# Altium schematic sheet rhd64_board_no_microdrive.SchDoc
size A4
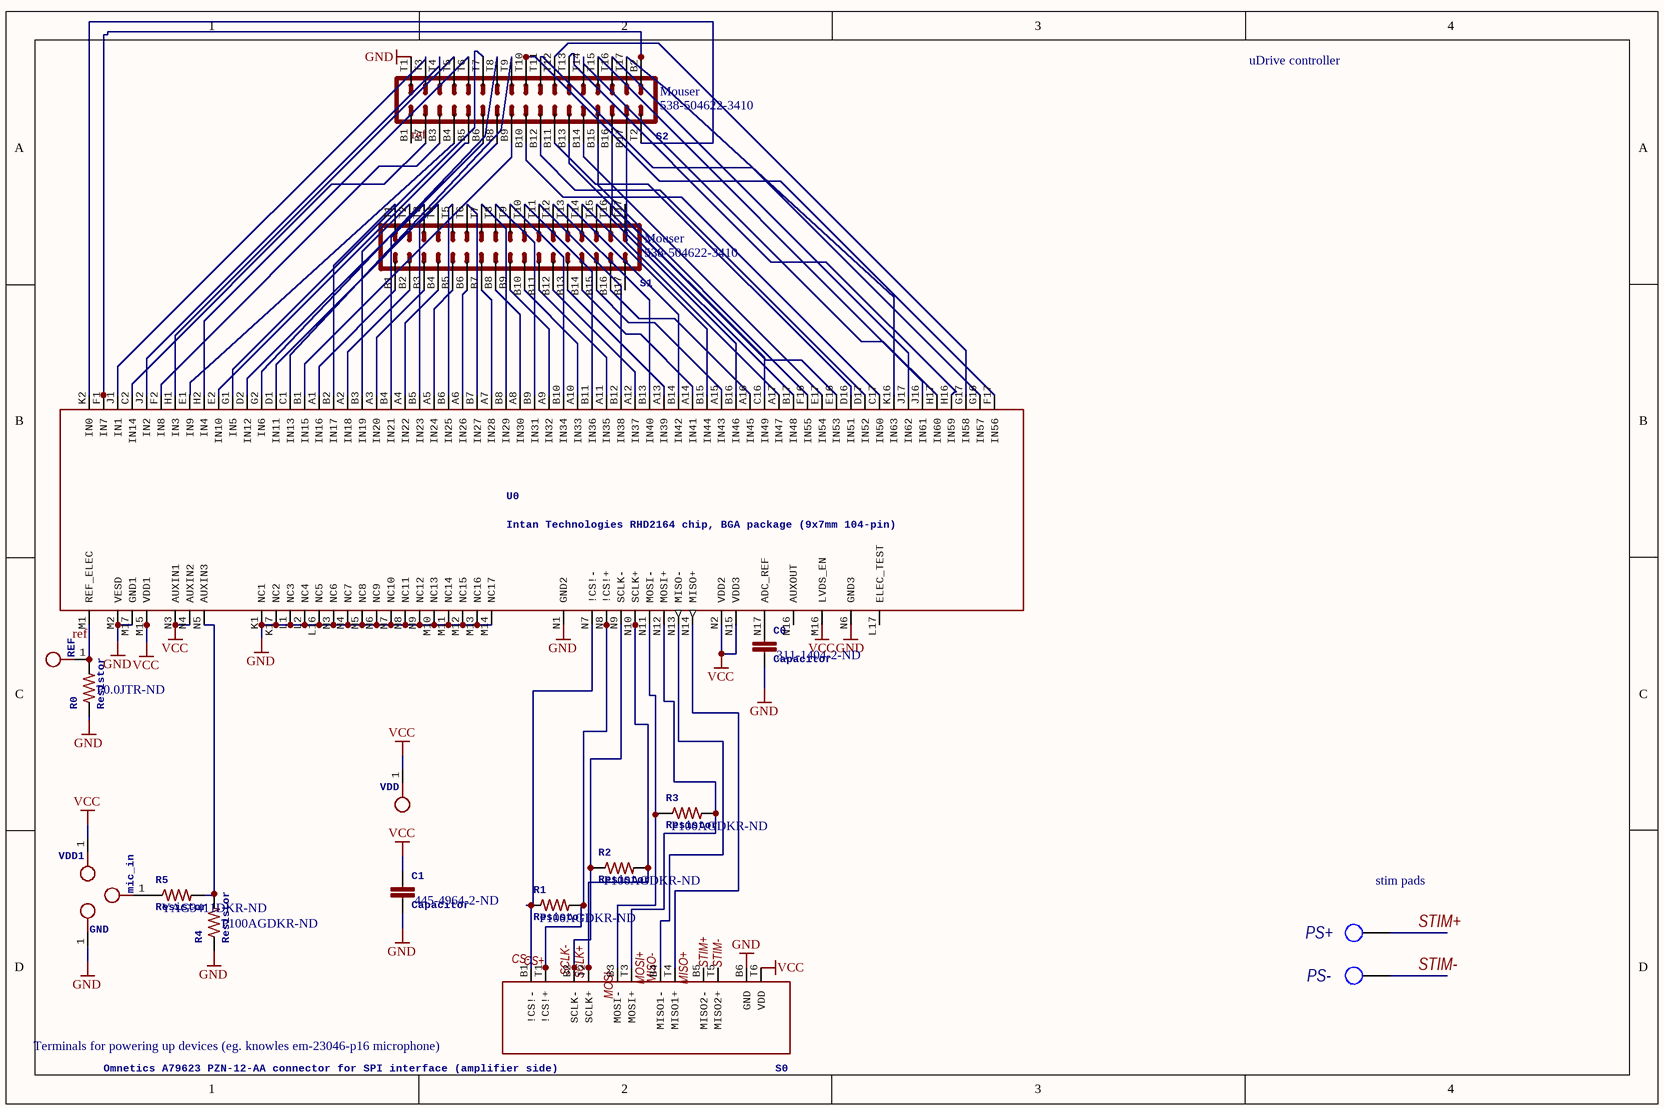
[diagram p0: rhd64_board_no_microdrive.SchDoc]

## Parts
C0  Capacitor  Supplier Part Number 1: 311-1404-2-ND  [0201]
C1  Capacitor  Supplier Part Number 1: 445-4964-2-ND  [0402]
GND  PCB Test Point  [TESTPOINT_SMALL]  (value not drawn)
mic_in  PCB Test Point  [TESTPOINT_SMALL]  (value not drawn)
PS+  2-2  [KP-025-04]  (value not drawn)
PS-  2-2  [KP-025-04]  (value not drawn)
R0  Resistor  Supplier Part Number 1: P0.0JTR-ND  [0402]
R1  Resistor  Supplier Part Number 1: P100AGDKR-ND  [0201]
R2  Resistor  Supplier Part Number 1: P100AGDKR-ND  [0201]
R3  Resistor  Supplier Part Number 1: P100AGDKR-ND  [0201]
R4  Resistor  Supplier Part Number 1: P100AGDKR-ND  [0201]
R5  Resistor  Supplier Part Number 1: YAG3411DKR-ND  [0201]
REF  PCB Test Point  [TESTPOINT_SMALL]  (value not drawn)
S0  Omnetics A79623 PZN-12-AA connector for SPI interface (amplifier side)  [OMNETICS_PZN-12-AA]
S1  Supplier 1: Mouser  Supplier Part Number 1: 538-504622-3410  [MOLEX_504622-3412]  (hidden comment: Molex 3.5mm Pitch Slimstack 34 pin connector)
S2  Supplier 1: Mouser  Supplier Part Number 1: 538-504622-3410  [MOLEX_504622-3412]  (hidden comment: Molex 3.5mm Pitch Slimstack 34 pin connector)
U0  Intan Technologies RHD2164 chip, BGA package (9x7mm 104-pin)  [BGA104_9X7]
VDD  PCB Test Point  [TESTPOINT_SMALL]  (value not drawn)
VDD1  PCB Test Point  [TESTPOINT_SMALL]  (value not drawn)

## Nets
GND: C0.2 C1.2 GND.1 R0.1 R4.1 S0.B6(GND) S2.T1 U0.K1(NC1) U0.K17(NC2) U0.L1(NC3) U0.L2(NC4) U0.L16(NC5) U0.M2(VESD) U0.M3(NC6) U0.M4(NC7) U0.M5(NC8) U0.M6(NC9) U0.M7(NC10) U0.M8(NC11) U0.M9(NC12) U0.M10(NC13) U0.M11(NC14) U0.M12(NC15) U0.M13(NC16) U0.M14(NC17) U0.M17(GND1) U0.N1(GND2) U0.N6(GND3)
VCC: C1.1 S0.T6(VDD) U0.M15(VDD1) U0.M16(LVDS_EN) U0.N2(VDD2) U0.N3(AUXIN1) U0.N4(AUXIN2) U0.N15(VDD3) VDD.1 VDD1.1
CS+: R1.2 S0.T1(!CS!+) U0.N8(!CS!+)
CS-: R1.1 S0.B1(!CS!-) U0.N7(!CS!-)
MISO+: S0.T4(MISO1+) U0.N14(MISO+)
MISO-: S0.B4(MISO1-) U0.N13(MISO-)
MOSI+: R3.2 S0.T3(MOSI+) U0.N12(MOSI+)
MOSI-: R3.1 S0.B3(MOSI-) U0.N11(MOSI-)
ref: R0.2 REF.1 S2.B1 U0.M1(REF_ELEC)
SCLK+: R2.2 S0.T2(SCLK+) U0.N10(SCLK+)
SCLK-: R2.1 S0.B2(SCLK-) U0.N9(SCLK-)
STIM+: PS+.1 S0.B5(MISO2-)
STIM-: PS-.1 S0.T5(MISO2+)
NetC0_1: C0.1 U0.N17(ADC_REF)
Netmic_in_1: mic_in.1 R5.1
NetR4_2: R4.2 R5.2 U0.N5(AUXIN3)
NetS1_B1: S1.B1 U0.A1(IN16)
NetS1_B2: S1.B2 U0.A2(IN18)
NetS1_B3: S1.B3 U0.A3(IN20)
NetS1_B4: S1.B4 U0.A4(IN22)
NetS1_B5: S1.B5 U0.A5(IN24)
NetS1_B6: S1.B6 U0.A6(IN26)
NetS1_B7: S1.B7 U0.A7(IN28)
NetS1_B8: S1.B8 U0.A8(IN30)
NetS1_B9: S1.B9 U0.A9(IN32)
NetS1_B10: S1.B10 U0.A10(IN33)
NetS1_B11: S1.B11 U0.A11(IN35)
NetS1_B12: S1.B12 U0.A12(IN37)
NetS1_B13: S1.B13 U0.A13(IN39)
NetS1_B14: S1.B14 U0.A14(IN41)
NetS1_B15: S1.B15 U0.A15(IN43)
NetS1_B16: S1.B16 U0.A16(IN45)
NetS1_T1: S1.T1 U0.B2(IN17)
NetS1_T2: S1.T2 U0.B3(IN19)
NetS1_T3: S1.T3 U0.B4(IN21)
NetS1_T4: S1.T4 U0.B5(IN23)
NetS1_T5: S1.T5 U0.B6(IN25)
NetS1_T6: S1.T6 U0.B7(IN27)
NetS1_T7: S1.T7 U0.B8(IN29)
NetS1_T8: S1.T8 U0.B9(IN31)
NetS1_T9: S1.T9 U0.B10(IN34)
NetS1_T10: S1.T10 U0.B11(IN36)
NetS1_T11: S1.T11 U0.B12(IN38)
NetS1_T12: S1.T12 U0.B13(IN40)
NetS1_T13: S1.T13 U0.B14(IN42)
NetS1_T14: S1.T14 U0.B15(IN44)
NetS1_T15: S1.T15 U0.B16(IN46)
NetS1_T16: S1.T16 S2.B13 U0.C16(IN49) U0.E16(IN53)
NetS2_B2: S2.B2 U0.F1(IN7)
NetS2_B3: S2.B3 U0.F2(IN8)
NetS2_B4: S2.B4 U0.E1(IN9)
NetS2_B5: S2.B5 U0.E2(IN10)
NetS2_B6: S2.B6 U0.D2(IN12)
NetS2_B7: S2.B7 U0.C2(IN14)
NetS2_B8: S2.B8 U0.D1(IN11)
NetS2_B9: S2.B9 U0.B1(IN15)
NetS2_B10: S2.B10 U0.C17(IN50)
NetS2_B11: S2.B11 U0.D16(IN51)
NetS2_B12: S2.B12 U0.D17(IN52)
NetS2_B14: S2.B14 U0.E17(IN54)
NetS2_B15: S2.B15 U0.F16(IN55)
NetS2_B16: S2.B16 U0.B17(IN48)
NetS2_B17: S2.B17 U0.A17(IN47)
NetS2_T2: S2.T2 U0.K2(IN0)
NetS2_T3: S2.T3 U0.J1(IN1)
NetS2_T4: S2.T4 U0.J2(IN2)
NetS2_T5: S2.T5 U0.H1(IN3)
NetS2_T6: S2.T6 U0.H2(IN4)
NetS2_T7: S2.T7 U0.G1(IN5)
NetS2_T8: S2.T8 U0.G2(IN6)
NetS2_T9: S2.T9 U0.C1(IN13)
NetS2_T10: S2.T10 U0.F17(IN56)
NetS2_T11: S2.T11 S2.T17 U0.G16(IN57) U0.K16(IN63)
NetS2_T12: S2.T12 U0.G17(IN58)
NetS2_T13: S2.T13 U0.H16(IN59)
NetS2_T14: S2.T14 U0.H17(IN60)
NetS2_T15: S2.T15 U0.J16(IN61)
NetS2_T16: S2.T16 U0.J17(IN62)

Not connected (* = marked no-connect by the designer): S1 B17 T17; U0 L17(ELEC_TEST) N16(AUXOUT)

## Notes on the sheet
- uDrive controller
- (near PS+) stim pads
- Terminals for powering up devices (eg. knowles em-23046-p16 microphone)

## Library data of the parts
C0 = C_10nF: ceramic 16v; GateName_1: C; DeviceName: _0201; SymbolName_1: C; LibraryName: RHD2000_eval_board; DeviceSetName: C; Package: 0201; Supplier 1: Digi-Key
C1 = C_100nf: ceramic capacitor (25 V). For pwer supply decoupling; GateName_1: C; DeviceName: _0402; SymbolName_1: C; LibraryName: RHD2000_eval_board; DeviceSetName: C; Package: 0402; Supplier 1: Digi-Key
GND mic_in REF VDD VDD1 = TESTPOINT_SMALL: GateName_1: TP$1; DeviceName: _SMALL; SymbolName_1: TESTPOINT; LibraryName: RHD2000_eval_board; DeviceSetName: TESTPOINT; Package: TESTPOINT_SMALL
PS+ PS- = KP-025X04
R0 = R_0ohm: resistor 0ohm; GateName_1: R; DeviceName: _0402; SymbolName_1: R; LibraryName: RHD2000_eval_board; DeviceSetName: R; Package: 0402; Supplier 1: Digi-Key
R1-R4 = R_100_LVDS: 100ohm resistor for lvds pair in 64ch; GateName_1: R; DeviceName: _0201; SymbolName_1: R; LibraryName: RHD2000_eval_board; DeviceSetName: R; Package: 0201; Supplier 1: Digi-Key
R5 = R_100k_mic: 100kohm resistor for voltage divisor knowles mic input; GateName_1: R; DeviceName: _0201; SymbolName_1: R; LibraryName: RHD2000_eval_board; DeviceSetName: R; Package: 0201; Supplier 1: Digi-Key
S0 = RHD2000-CABLE-AMP-SIDE: GateName_1: A; SymbolName_1: RHD2000-CABLE; LibraryName: RHD2000; DeviceSetName: RHD2000-CABLE-AMP-SIDE; Package: OMNETICS_PZN-12-AA
S1 S2 = MOLEX_504622-3412: GateName_1: A; SymbolName_1: OMNETICS_A7902X; DeviceSetName: OMNETICS_A79024; LibraryName: RHD2000_eval_board; Package: OMNETICS_A79024
U0 = RHD2164_BGA_BGA: GateName_1: A; DeviceName: _BGA; SymbolName_1: RHD2164_BGA; LibraryName: RHD2000; DeviceSetName: RHD2164_BGA; Package: BGA104_9X7